# Altium schematic sheet CAN Adaptor.SchDoc
size A3; SheetNumber: 5; SheetTotal: 5
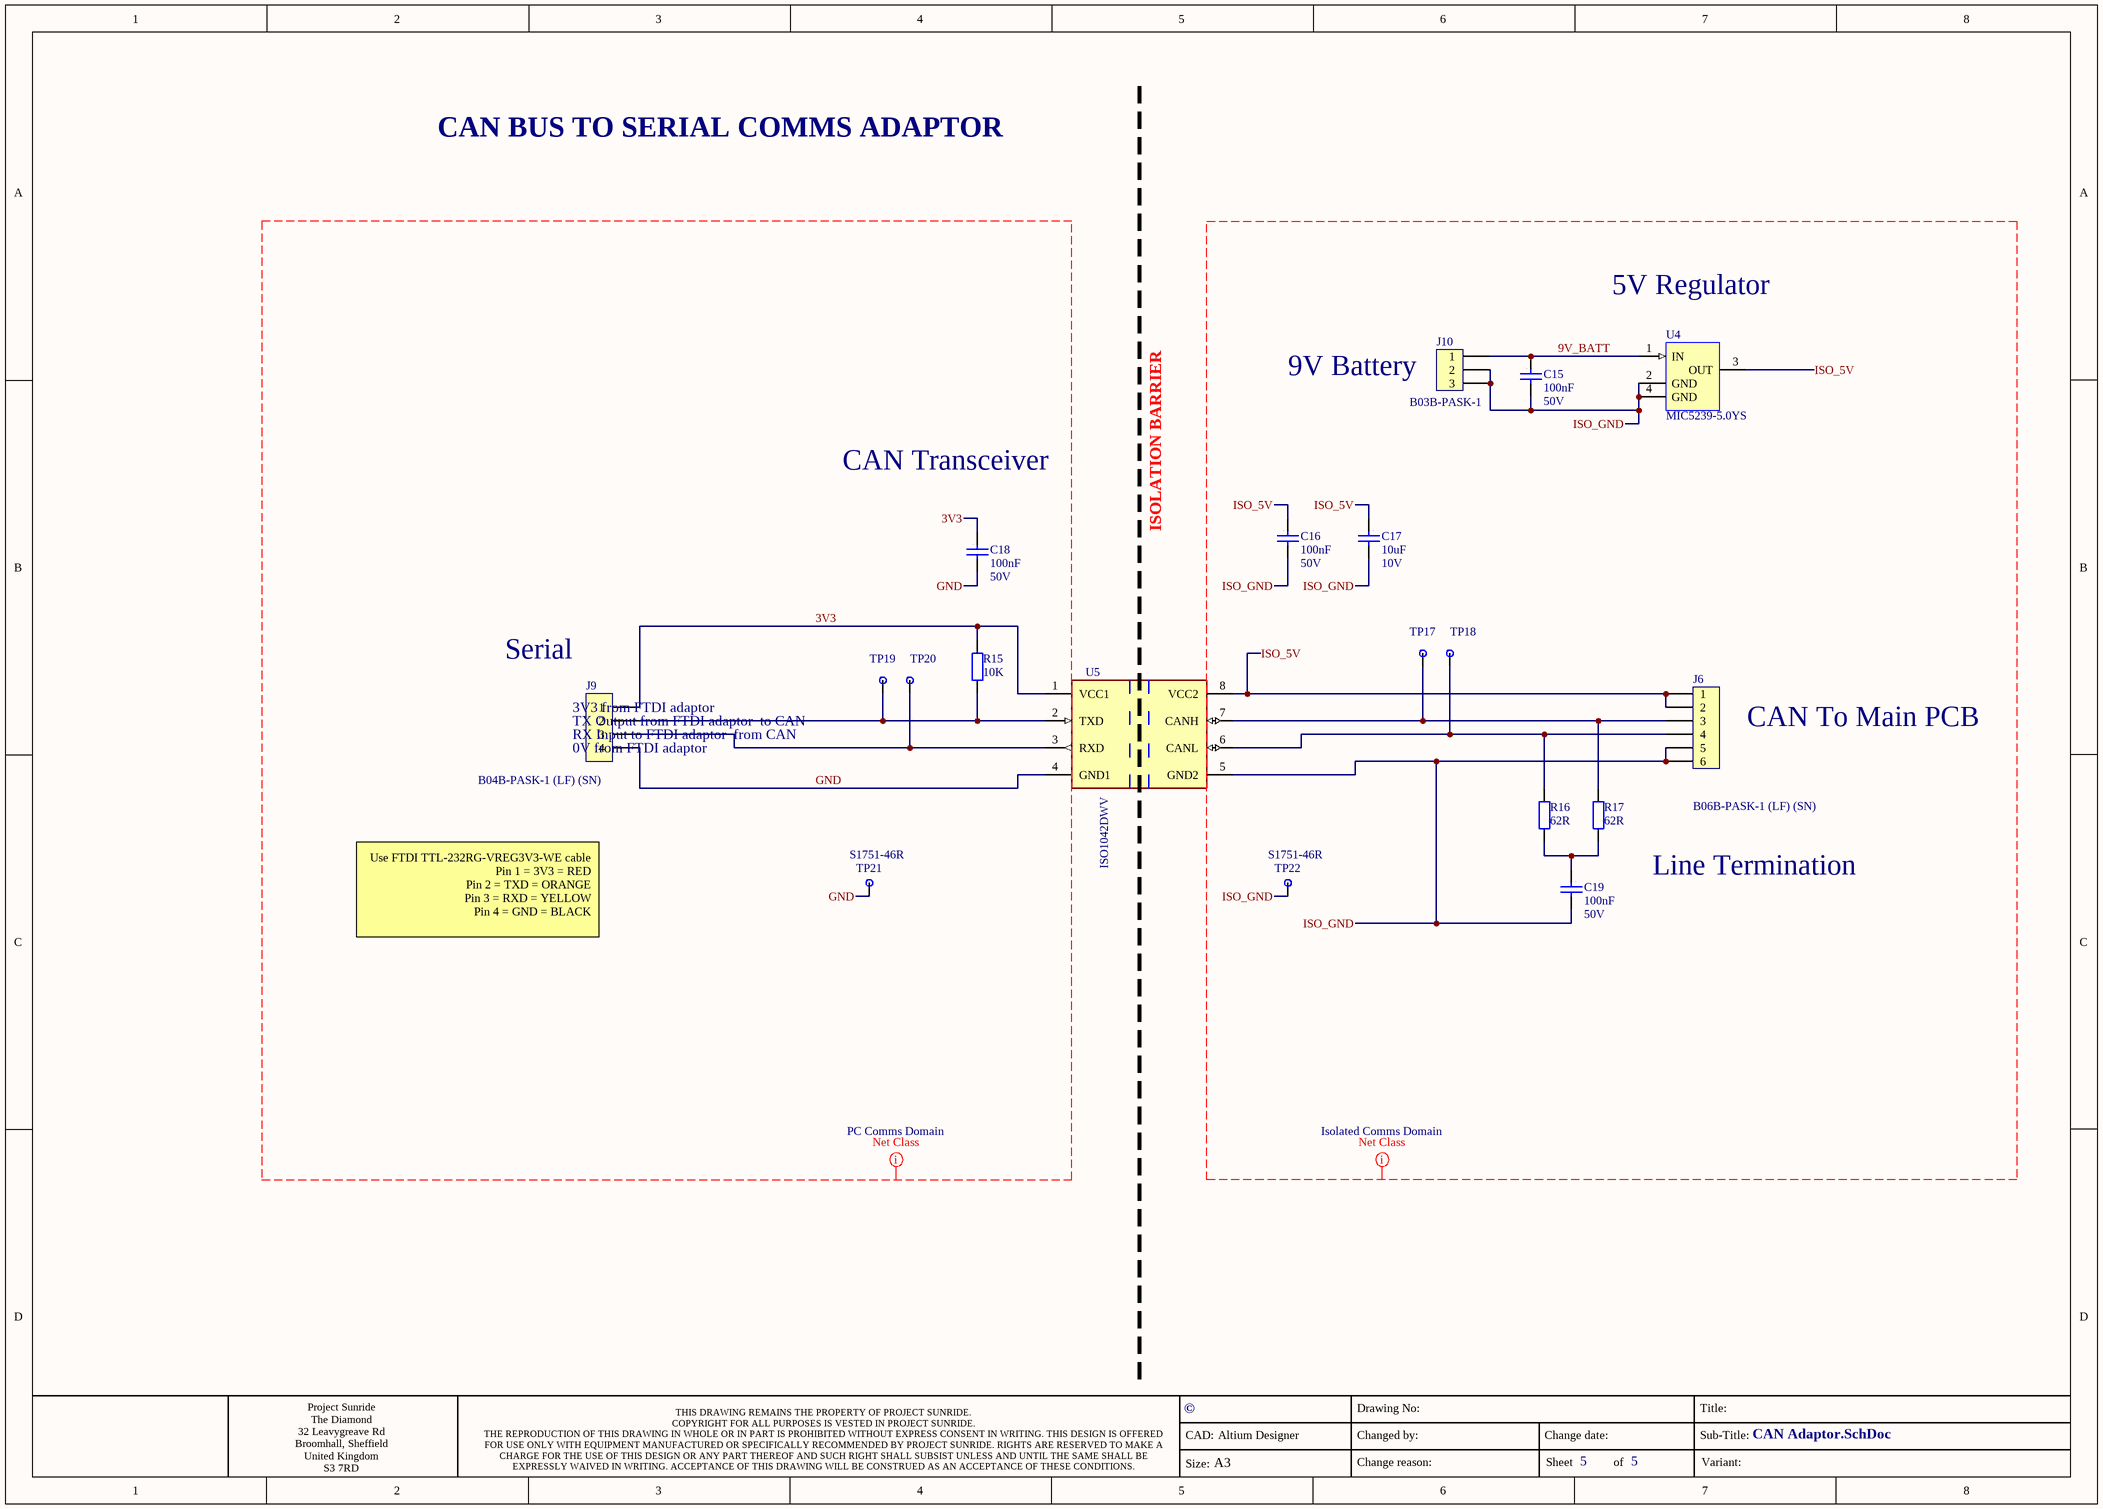
[diagram p0: CAN Adaptor.SchDoc]

## Parts
C15  value 100nF  Voltage: 50V  [CAPC1608X08L]  (hidden comment: *)
C16  value 100nF  Voltage: 50V  [CAPC1608X08L]  (hidden comment: *)
C17  value 10uF  Voltage: 10V  [CAPC2012X15M]  (hidden comment: *)
C18  value 100nF  Voltage: 50V  [CAPC1608X08L]  (hidden comment: *)
C19  value 100nF  Voltage: 50V  [CAPC1608X08L]  (hidden comment: *)
J6  CAN To Main PCB  ManuPartNo: B06B-PASK-1 (LF) (SN)  [B06B-PASK-1]
J9  Serial  ManuPartNo: B04B-PASK-1 (LF) (SN)  [B04B-PASK-1]
J10  9V Battery  [B03B-PASK-1]
R15  value 10K  [RESC1608X06L]  (hidden comment: RESISTOR)
R16  value 62R  [RESC1608X06L]  (hidden comment: *)
R17  Line Termination  value 62R  [RESC1608X06L]
TP17  TMS  [TP1]  (value not drawn)  (no BOM)
TP18  TMS  [TP1]  (value not drawn)  (no BOM)
TP19  TMS  [TP1]  (value not drawn)  (no BOM)
TP20  TMS  [TP1]  (value not drawn)  (no BOM)
TP21  GND  [S1751-46R]  (value not drawn)
TP22  GND  [S1751-46R]  (value not drawn)
U4  5V Regulator  ManuPartNo: MIC5239-5.0YS  [SOT230P700X170-4M]
U5  CAN Transceiver  Manuf Part No: ISO1042DWV  [FP-DWV0008A-IPC_C]

## Nets
3V3: C18.1 J9.1 R15.2 U5.1(VCC1)
9V_BATT: C15.1 J10.1 U4.1(IN)
GND: C18.2 J9.4 TP21.1 U5.4(GND1)
ISO_5V: C16.1 C17.1 J6.1 J6.2 U4.3(OUT) U5.8(VCC2)
ISO_GND: C15.2 C16.2 C17.2 C19.2 J6.5 J6.6 J10.2 J10.3 TP22.1 U4.2(GND) U4.4(GND) U5.5(GND2)
NetC19_1: C19.1 R16.1 R17.1
NetJ6_3: J6.3 R17.2 TP17.1 U5.7(CANH)
NetJ6_4: J6.4 R16.2 TP18.1 U5.6(CANL)
NetJ9_2: J9.2 R15.1 TP19.1 U5.2(TXD)
NetJ9_3: J9.3 TP20.1 U5.3(RXD)

## Layout directives
net class PC Comms Domain: 3V3, GND
net class Isolated Comms Domain: 9V_BATT, ISO_5V, ISO_GND

## Notes on the sheet
- CAN BUS TO SERIAL COMMS ADAPTOR
- ISOLATION BARRIER
- (near J9) TX Output from FTDI adaptor  to CAN
- (near J9) 3V3 from FTDI adaptor
- (near J9) RX Input to FTDI adaptor  from CAN
- (near J9) 0V from FTDI adaptor
- Use FTDI TTL-232RG-VREG3V3-WE cable
  Pin 1 = 3V3 = RED
  Pin 2 = TXD = ORANGE
  Pin 3 = RXD = YELLOW
  Pin 4 = GND = BLACK
- ©
- CAD:
- Altium Designer
- Changed by:
- Drawing No:
- Change date:
- Title:
- Sub-Title:
- Project Sunride
  The Diamond
  32 Leavygreave Rd
  Broomhall, Sheffield
  United Kingdom
  S3 7RD
- THIS DRAWING REMAINS THE PROPERTY OF PROJECT SUNRIDE.
  COPYRIGHT FOR ALL PURPOSES IS VESTED IN PROJECT SUNRIDE.
  THE REPRODUCTION OF THIS DRAWING IN WHOLE OR IN PART IS PROHIBITED WITHOUT EXPRESS CONSENT IN WRITING. THIS DESIGN IS OFFERED FOR USE ONLY WITH EQUIPMENT MANUFACTURED OR SPECIFICALLY RECOMMENDED BY PROJECT SUNRIDE. RIGHTS ARE RESERVED TO MAKE A CHARGE FOR THE USE OF THIS DESIGN OR ANY PART THEREOF AND SUCH RIGHT SHALL SUBSIST UNLESS AND UNTIL THE SAME SHALL BE EXPRESSLY WAIVED IN WRITING. ACCEPTANCE OF THIS DRAWING WILL BE CONSTRUED AS AN ACCEPTANCE OF THESE CONDITIONS.
- Size:
- A3
- Change reason:
- Sheet
- of
- Variant:

## Library data of the parts
C15 C16 C18 C19 = FEC882-0023: Capacitor MLC 100nF 50V X7R 10% CAPC1608X08M; Manufacturer: Murata; ManuPartNo: GRM188R71H104KA93D; Cost 1+: 0.064; Cost 1K+: 0.039; Life: V; Source: FEC882-0023; Dielectric: X7R; Tolerance: 10%; Class: Capacitor MLC; RoHS: Y; Created: 25/01/2013; Last_Updated: 25/01/2013; Supplier 1: Farnell; Supplier Part Number 1: 8820023
C17 = Mouser81-GRM21BR71A106KE51: Capacitor MLC 10uF10V X7R 10% CAPC2012X15M; Manufacturer: Murata; ManuPartNo: GRM21BR71A106KE51L; Cost 1+: 0.189; Cost 1K+: 0.046; Life: V; Source: Mouser81-GRM21BR71A106KE51; Dielectric: X7R; Supplier 1: Mouser; Supplier Part Number 1: 81-GRM21BR71A106KE51; Tolerance: 10%; Class: Capacitor MLC; RoHS: Y; Created: 21/12/2016; Last_Updated: 21/12/2016
J6 = FEC183-0743: Connector 6 Way Vertical B06B-PASK-1 (LF) (SN) 2mm Pitch; Manufacturer: JST; Cost 1+: 0.55; Cost 1K+: 0.2; Life: V; Source: FEC183-0743; Pin Count: 6; Orient: Vertical; Supplier 1: Farnell; Supplier Part Number 1: 1830743; Pitch: 2mm; Class: Connector; RoHS: Y; Created: 21/06/2013; Last_Updated: 21/06/2013
J9 = RS512-8608: Connector 4 Way Vertical JST B04B-PASK-1 (LF) (SN) 2mm Pitch; Cost 1+: 0.26; Cost 1K+: 0.24; Life: V; Source: RS512-8608; Pin Count: 4; Orient: Vertical; Manufacturer: JST; Supplier 1: RSComponents; Supplier Part Number 1: 512-8608; Pitch: 2mm; Class: Connector; RoHS: Y; Created: 05/06/2013; Last_Updated: 05/06/2013
J10 = FEC183-0736: Connector 3 Way Vertical 2mm Pitch; Manufacturer: JST; Cost 1+: 0.34; Cost 1K+: 0.118; Life: V; Source: FEC183-0736; ManuPartNo: B03B-PASK-1; Pin Count: 3; Orient: Vertical; Supplier 1: Farnell; Supplier Part Number 1: 1830736; Pitch: 2mm; Class: Connector; RoHS: Y; Created: 09/08/2013; Last_Updated: 09/08/2013
R15 = PanasonicERA3AEB103V: SMD Chip Resistor, Thin Film, 10 kohm, 75 V, 0603 [1608 Metric], 100 mW, ± 0.1%, ERA3A Series; Voltage: 75V; Cost 1+: 0.237; Cost 1K+: 0.053; Power: 100mW; Source: PanasonicERA3AEB103V; Manufacturer: Panasonic; ManuPartNo: ERA3AEB103V; Supplier 1: Farnell; Supplier Part Number 1: 1577619; Tolerance: 0.1%; Class: Resistor; RoHS: Y; Life: V; Created: 27/02/2018; Last_Updated: 27/02/2018; ComponentLink1Description: Datasheet; ComponentLink1URL: C:\Altium SANDBOX\Component Database\Datasheet\Panasonic Resistors.pdf
R16 R17 = Mouser603-RC0603FR-0762RL: SMD Chip Resistor, Thick Film, 62 ohm, 75V, 0603 [1608 Metric], 100mW, ± 1%, RC Series; Manufacturer: Yageo; Cost 1+: 0.074; Cost 1K+: 0.002; Life: V; Source: Mouser603-RC0603FR-0762RL; Voltage: 75V; Power: 100mW; ManuPartNo: RC0603FR-0762RL; Supplier 1: Mouser; Supplier Part Number 1: 603-RC0603FR-0762RL; Tolerance: 1%; Class: Resistor; RoHS: Y; Created: 08/06/2018; Last_Updated: 08/06/2018; ComponentLink1Description: Datasheet; ComponentLink1URL: C:\Altium SANDBOX\Component Database\Datasheet\Yageo RC_L Series.pdf
TP17-TP20 = Misc TP1: Testpoint 1mm dia. Component side, no silk; Source: Misc TP1; Class: Testpoint; Created: 26/01/2013; Last_Updated: 26/01/2013; Supplier 1: Misc; Supplier Part Number 1: TP1
TP21 TP22 = FEC2293786: PCB Test Point S1751 Series, Surface Mount; Manufacturer: Harwin; Orient: Vertical; Cost 1+: 0.134; Cost 1K+: 0.106; Class: Connector; Life: V; Source: FEC2293786; ManuPartNo: S1751-46R; Pin Count: 1; Supplier 1: Farnell; Supplier Part Number 1: 2293786; RoHS: Y; Created: 16/10/2017; Last_Updated: 01/12/2017; ComponentLink1Description: Datasheet; ComponentLink1URL: C:\Altium SANDBOX\Component Database\Datasheet\S1751-46R.pdf
U4 = FEC210-0330: IC Regulator LDO MIC5239-5.0YS SOT-223; Manufacturer: Micrel; Cost 1+: 3.22; Cost 1K+: 1.3; Class: IC LDO Regulator; Life: V; Source: FEC210-0330; Supplier 1: Farnell; Supplier Part Number 1: 2100330; RoHS: Y; Created: 23/01/2014; Last_Updated: 23/01/2014; ComponentLink1Description: Datasheet; ComponentLink1URL: C:\Altium SANDBOX\Component Database\Datasheet\MIC5239.pdf
U5 = CMP-04872-000132-1: IC TRANSCEIVER FULL 1/1 8SOIC; RoHS Compliant: Yes